# EAGLE schematic core+io5 (EAGLE 6.6.0)

## Sheet 1 of 3
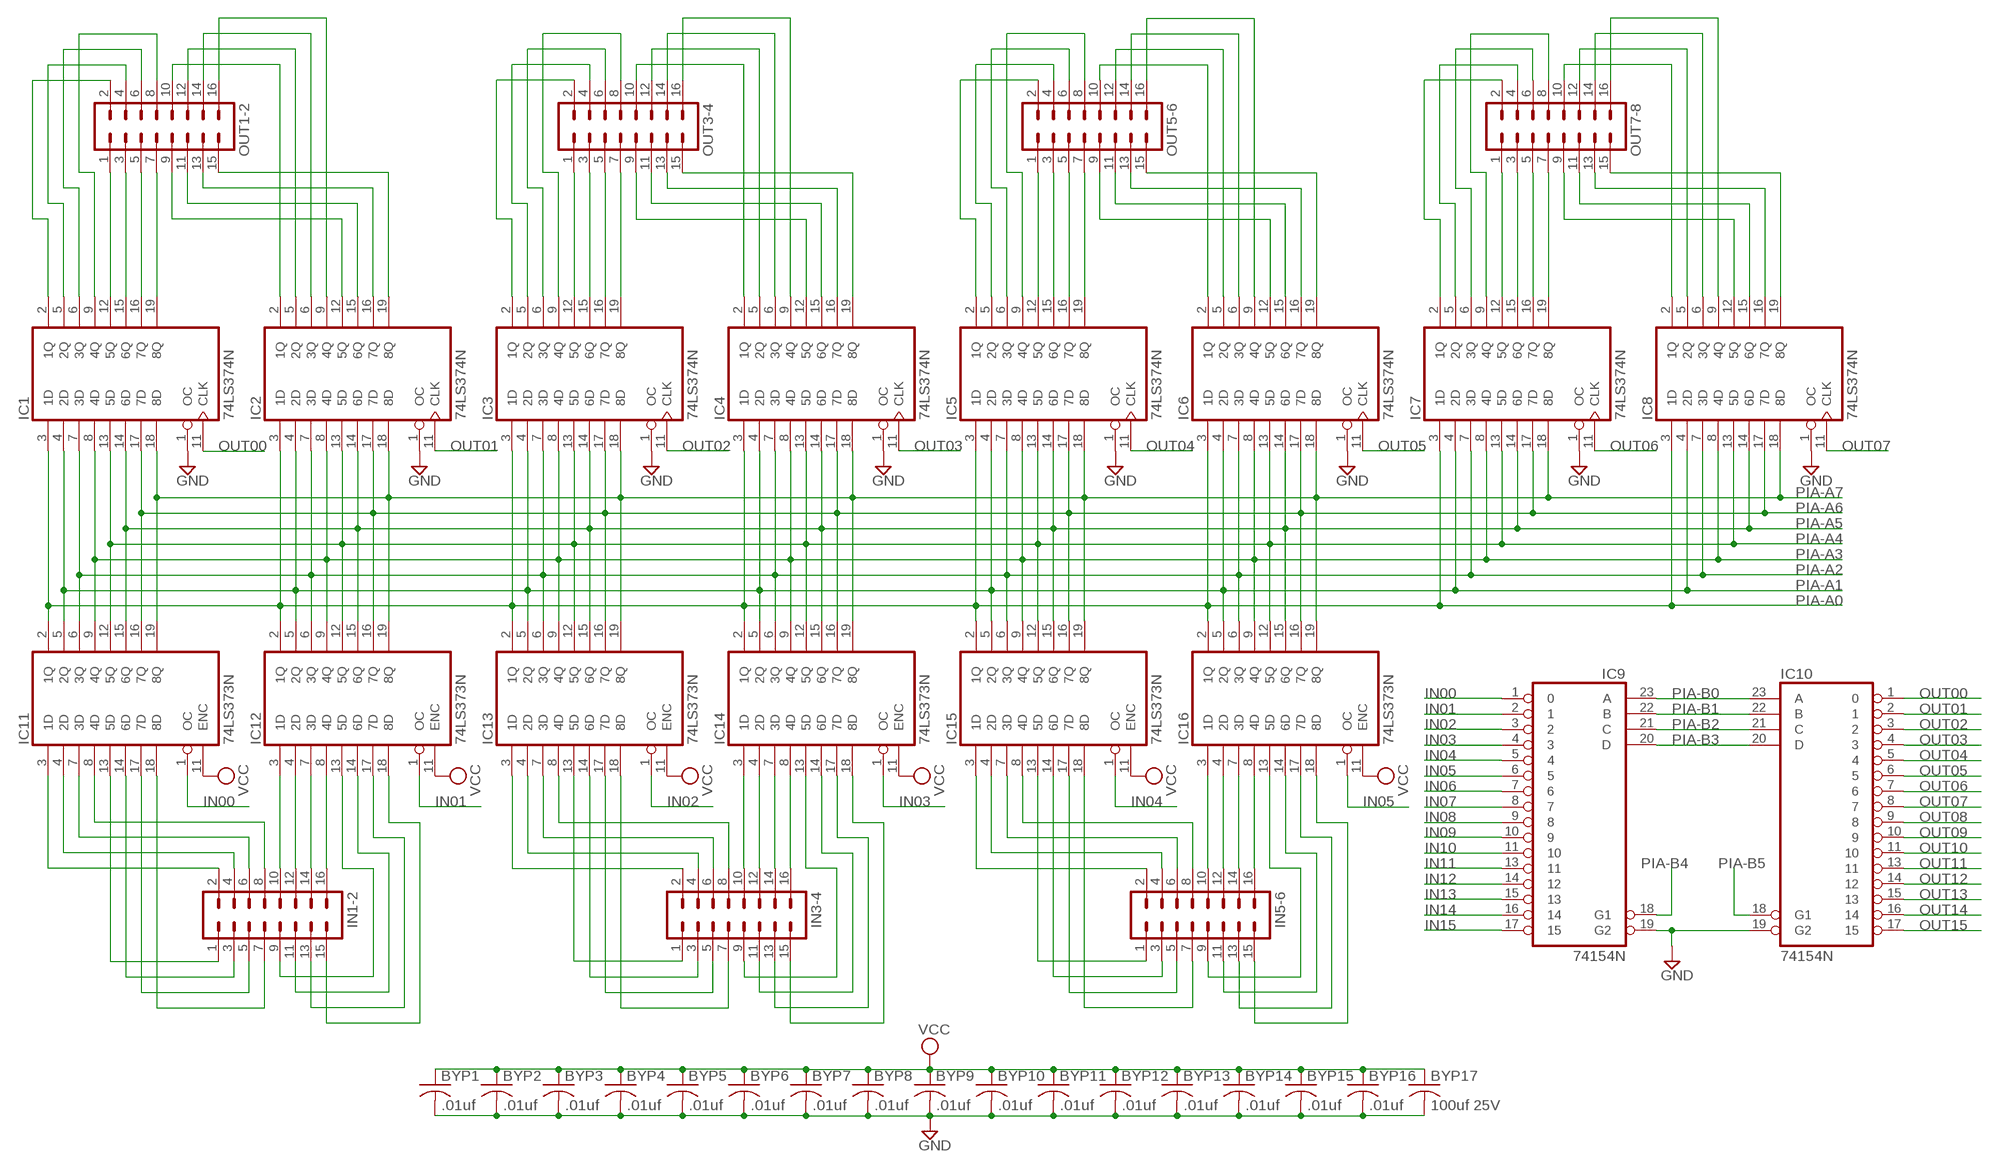
[diagram p0: schematic, sheet 1]

### Parts
BYP1  .01uf  C-US050-025X075  [C050-025X075]
BYP2  .01uf  C-US050-025X075  [C050-025X075]
BYP3  .01uf  C-US050-025X075  [C050-025X075]
BYP4  .01uf  C-US050-025X075  [C050-025X075]
BYP5  .01uf  C-US050-025X075  [C050-025X075]
BYP6  .01uf  C-US050-025X075  [C050-025X075]
BYP7  .01uf  C-US050-025X075  [C050-025X075]
BYP8  .01uf  C-US050-025X075  [C050-025X075]
BYP9  .01uf  C-US050-025X075  [C050-025X075]
BYP10  .01uf  C-US050-025X075  [C050-025X075]
BYP11  .01uf  C-US050-025X075  [C050-025X075]
BYP12  .01uf  C-US050-025X075  [C050-025X075]
BYP13  .01uf  C-US050-025X075  [C050-025X075]
BYP14  .01uf  C-US050-025X075  [C050-025X075]
BYP15  .01uf  C-US050-025X075  [C050-025X075]
BYP16  .01uf  C-US050-025X075  [C050-025X075]
BYP17  100uf 25V  C-US102-043X133  [C102-043X133]
IC1  74LS374N  [DIL20]
IC2  74LS374N  [DIL20]
IC3  74LS374N  [DIL20]
IC4  74LS374N  [DIL20]
IC5  74LS374N  [DIL20]
IC6  74LS374N  [DIL20]
IC7  74LS374N  [DIL20]
IC8  74LS374N  [DIL20]
IC9  74154N  [DIL24-6]
IC10  74154N  [DIL24-6]
IC11  74LS373N  [DIL20]
IC12  74LS373N  [DIL20]
IC13  74LS373N  [DIL20]
IC14  74LS373N  [DIL20]
IC15  74LS373N  [DIL20]
IC16  74LS373N  [DIL20]
IN1-2  MA08-2  [MA08-2]
IN3-4  MA08-2  [MA08-2]
IN5-6  MA08-2  [MA08-2]
OUT1-2  MA08-2  [MA08-2]
OUT3-4  MA08-2  [MA08-2]
OUT5-6  MA08-2  [MA08-2]
OUT7-8  MA08-2  [MA08-2]

### Nets
GND [Power]: BYP1.2 BYP2.2 BYP3.2 BYP4.2 BYP5.2 BYP6.2 BYP7.2 BYP8.2 BYP9.2 BYP10.2 BYP11.2 BYP12.2 BYP13.2 BYP14.2 BYP15.2 BYP16.2 BYP17.2 IC1.1(OC) IC2.1(OC) IC3.1(OC) IC4.1(OC) IC5.1(OC) IC6.1(OC) IC7.1(OC) IC8.1(OC) IC9.19(G2) IC10.19(G2) ; also sheet 2,3
IN00: IC9.1 IC11.1(OC)
IN01: IC9.2 IC12.1(OC)
IN02: IC9.3 IC13.1(OC)
IN03: IC9.4 IC14.1(OC)
IN04: IC9.5 IC15.1(OC)
IN05: IC9.6 IC16.1(OC)
IN06: IC9.7
IN07: IC9.8
IN08: IC9.9
IN09: IC9.10
IN10: IC9.11
IN11: IC9.13
IN12: IC9.14
IN13: IC9.15
IN14: IC9.16
IN15: IC9.17
N$1: IC12.3(1D) IN1-2.10
N$2: IC12.4(2D) IN1-2.12
N$7: IC12.7(3D) IN1-2.14
N$8: IC12.8(4D) IN1-2.16
N$9: IC11.8(4D) IN1-2.8
N$10: IC11.7(3D) IN1-2.6
N$11: IC11.4(2D) IN1-2.4
N$12: IC11.3(1D) IN1-2.2
N$13: IC11.13(5D) IN1-2.1
N$14: IC11.14(6D) IN1-2.3
N$15: IC11.17(7D) IN1-2.5
N$16: IC11.18(8D) IN1-2.7
N$17: IC12.13(5D) IN1-2.9
N$18: IC12.14(6D) IN1-2.11
N$19: IC12.17(7D) IN1-2.13
N$20: IC12.18(8D) IN1-2.15
N$26: IC5.2(1Q) OUT5-6.2
N$29: IC14.3(1D) IN3-4.10
N$30: IC14.4(2D) IN3-4.12
N$31: IC14.7(3D) IN3-4.14
N$32: IC14.8(4D) IN3-4.16
N$33: IC3.12(5Q) OUT3-4.1
N$34: IC3.15(6Q) OUT3-4.3
N$35: IC3.16(7Q) OUT3-4.5
N$36: IC3.19(8Q) OUT3-4.7
N$37: IC13.3(1D) IN3-4.2
N$38: IC13.4(2D) IN3-4.4
N$39: IC13.7(3D) IN3-4.6
N$40: IC13.8(4D) IN3-4.8
N$41: IC14.13(5D) IN3-4.9
N$42: IC14.14(6D) IN3-4.11
N$43: IC14.17(7D) IN3-4.13
N$44: IC14.18(8D) IN3-4.15
N$45: IC13.13(5D) IN3-4.1
N$46: IC13.14(6D) IN3-4.3
N$47: IC13.17(7D) IN3-4.5
N$48: IC13.18(8D) IN3-4.7
N$49: IC3.5(2Q) OUT3-4.4
N$50: IC3.6(3Q) OUT3-4.6
N$51: IC3.2(1Q) OUT3-4.2
N$52: IC3.9(4Q) OUT3-4.8
N$53: IC1.12(5Q) OUT1-2.1
N$54: IC1.15(6Q) OUT1-2.3
N$55: IC1.16(7Q) OUT1-2.5
N$56: IC1.19(8Q) OUT1-2.7
N$57: IC1.2(1Q) OUT1-2.2
N$58: IC1.5(2Q) OUT1-2.4
N$59: IC1.6(3Q) OUT1-2.6
N$60: IC1.9(4Q) OUT1-2.8
N$61: IC2.19(8Q) OUT1-2.15
N$62: IC2.16(7Q) OUT1-2.13
N$63: IC2.15(6Q) OUT1-2.11
N$64: IC2.12(5Q) OUT1-2.9
N$65: IC2.2(1Q) OUT1-2.10
N$66: IC2.5(2Q) OUT1-2.12
N$67: IC2.6(3Q) OUT1-2.14
N$68: IC2.9(4Q) OUT1-2.16
N$69: IC4.2(1Q) OUT3-4.10
N$70: IC4.5(2Q) OUT3-4.12
N$71: IC4.6(3Q) OUT3-4.14
N$72: IC4.9(4Q) OUT3-4.16
N$73: IC4.19(8Q) OUT3-4.15
N$74: IC4.16(7Q) OUT3-4.13
N$75: IC4.15(6Q) OUT3-4.11
N$76: IC4.12(5Q) OUT3-4.9
N$77: IC16.3(1D) IN5-6.10
N$78: IC16.4(2D) IN5-6.12
N$79: IC16.7(3D) IN5-6.14
N$80: IC16.8(4D) IN5-6.16
N$81: IC5.12(5Q) OUT5-6.1
N$82: IC5.15(6Q) OUT5-6.3
N$83: IC5.16(7Q) OUT5-6.5
N$84: IC5.19(8Q) OUT5-6.7
N$85: IC7.12(5Q) OUT7-8.1
N$86: IC7.15(6Q) OUT7-8.3
N$87: IC7.16(7Q) OUT7-8.5
N$88: IC7.19(8Q) OUT7-8.7
N$89: IC5.5(2Q) OUT5-6.4
N$90: IC5.6(3Q) OUT5-6.6
N$91: IC5.9(4Q) OUT5-6.8
N$92: IC6.12(5Q) OUT5-6.9
N$93: IC6.15(6Q) OUT5-6.11
N$95: IC6.16(7Q) OUT5-6.13
N$96: IC6.19(8Q) OUT5-6.15
N$97: IC6.2(1Q) OUT5-6.10
N$98: IC6.5(2Q) OUT5-6.12
N$99: IC6.6(3Q) OUT5-6.14
N$100: IC6.9(4Q) OUT5-6.16
N$101: IC15.3(1D) IN5-6.2
N$102: IC15.4(2D) IN5-6.4
N$103: IC15.7(3D) IN5-6.6
N$104: IC15.8(4D) IN5-6.8
N$105: IC16.13(5D) IN5-6.9
N$106: IC16.14(6D) IN5-6.11
N$107: IC16.17(7D) IN5-6.13
N$108: IC16.18(8D) IN5-6.15
N$109: IC15.13(5D) IN5-6.1
N$110: IC15.14(6D) IN5-6.3
N$111: IC15.17(7D) IN5-6.5
N$112: IC15.18(8D) IN5-6.7
N$113: IC8.19(8Q) OUT7-8.15
N$114: IC8.16(7Q) OUT7-8.13
N$115: IC8.15(6Q) OUT7-8.11
N$116: IC8.12(5Q) OUT7-8.9
N$117: IC8.2(1Q) OUT7-8.10
N$118: IC8.5(2Q) OUT7-8.12
N$119: IC8.6(3Q) OUT7-8.14
N$120: IC8.9(4Q) OUT7-8.16
N$121: IC7.9(4Q) OUT7-8.8
N$122: IC7.6(3Q) OUT7-8.6
N$123: IC7.5(2Q) OUT7-8.4
N$139: IC7.2(1Q) OUT7-8.2
OUT00: IC1.11(CLK) IC10.1
OUT01: IC2.11(CLK) IC10.2
OUT02: IC3.11(CLK) IC10.3
OUT03: IC4.11(CLK) IC10.4
OUT04: IC5.11(CLK) IC10.5
OUT05: IC6.11(CLK) IC10.6
OUT06: IC7.11(CLK) IC10.7
OUT07: IC8.11(CLK) IC10.8
OUT08: IC10.9
OUT09: IC10.10
OUT10: IC10.11
OUT11: IC10.13
OUT12: IC10.14
OUT13: IC10.15
OUT14: IC10.16
OUT15: IC10.17
PIA-A0: IC1.3(1D) IC2.3(1D) IC3.3(1D) IC4.3(1D) IC5.3(1D) IC6.3(1D) IC7.3(1D) IC8.3(1D) IC11.2(1Q) IC12.2(1Q) IC13.2(1Q) IC14.2(1Q) IC15.2(1Q) IC16.2(1Q) ; also sheet 2,3
PIA-A1: IC1.4(2D) IC2.4(2D) IC3.4(2D) IC4.4(2D) IC5.4(2D) IC6.4(2D) IC7.4(2D) IC8.4(2D) IC11.5(2Q) IC12.5(2Q) IC13.5(2Q) IC14.5(2Q) IC15.5(2Q) IC16.5(2Q) ; also sheet 2,3
PIA-A2: IC1.7(3D) IC2.7(3D) IC3.7(3D) IC4.7(3D) IC5.7(3D) IC6.7(3D) IC7.7(3D) IC8.7(3D) IC11.6(3Q) IC12.6(3Q) IC13.6(3Q) IC14.6(3Q) IC15.6(3Q) IC16.6(3Q) ; also sheet 2,3
PIA-A3: IC1.8(4D) IC2.8(4D) IC3.8(4D) IC4.8(4D) IC5.8(4D) IC6.8(4D) IC7.8(4D) IC8.8(4D) IC11.9(4Q) IC12.9(4Q) IC13.9(4Q) IC14.9(4Q) IC15.9(4Q) IC16.9(4Q) ; also sheet 2,3
PIA-A4: IC1.13(5D) IC2.13(5D) IC3.13(5D) IC4.13(5D) IC5.13(5D) IC6.13(5D) IC7.13(5D) IC8.13(5D) IC11.12(5Q) IC12.12(5Q) IC13.12(5Q) IC14.12(5Q) IC15.12(5Q) IC16.12(5Q) ; also sheet 2,3
PIA-A5: IC1.14(6D) IC2.14(6D) IC3.14(6D) IC4.14(6D) IC5.14(6D) IC6.14(6D) IC7.14(6D) IC8.14(6D) IC11.15(6Q) IC12.15(6Q) IC13.15(6Q) IC14.15(6Q) IC15.15(6Q) IC16.15(6Q) ; also sheet 2,3
PIA-A6: IC1.17(7D) IC2.17(7D) IC3.17(7D) IC4.17(7D) IC5.17(7D) IC6.17(7D) IC7.17(7D) IC8.17(7D) IC11.16(7Q) IC12.16(7Q) IC13.16(7Q) IC14.16(7Q) IC15.16(7Q) IC16.16(7Q) ; also sheet 2,3
PIA-A7: IC1.18(8D) IC2.18(8D) IC3.18(8D) IC4.18(8D) IC5.18(8D) IC6.18(8D) IC7.18(8D) IC8.18(8D) IC11.19(8Q) IC12.19(8Q) IC13.19(8Q) IC14.19(8Q) IC15.19(8Q) IC16.19(8Q) ; also sheet 2,3
PIA-B0: IC9.23(A) IC10.23(A) ; also sheet 2,3
PIA-B1: IC9.22(B) IC10.22(B) ; also sheet 2,3
PIA-B2: IC9.21(C) IC10.21(C) ; also sheet 2,3
PIA-B3: IC9.20(D) IC10.20(D) ; also sheet 2,3
PIA-B4: IC9.18(G1) ; also sheet 2,3
PIA-B5: IC10.18(G1) ; also sheet 2,3
VCC [Power]: BYP1.1 BYP2.1 BYP3.1 BYP4.1 BYP5.1 BYP6.1 BYP7.1 BYP8.1 BYP9.1 BYP10.1 BYP11.1 BYP12.1 BYP13.1 BYP14.1 BYP15.1 BYP16.1 BYP17.1 IC11.11(ENC) IC12.11(ENC) IC13.11(ENC) IC14.11(ENC) IC15.11(ENC) IC16.11(ENC) ; also sheet 2,3

## Sheet 2 of 3
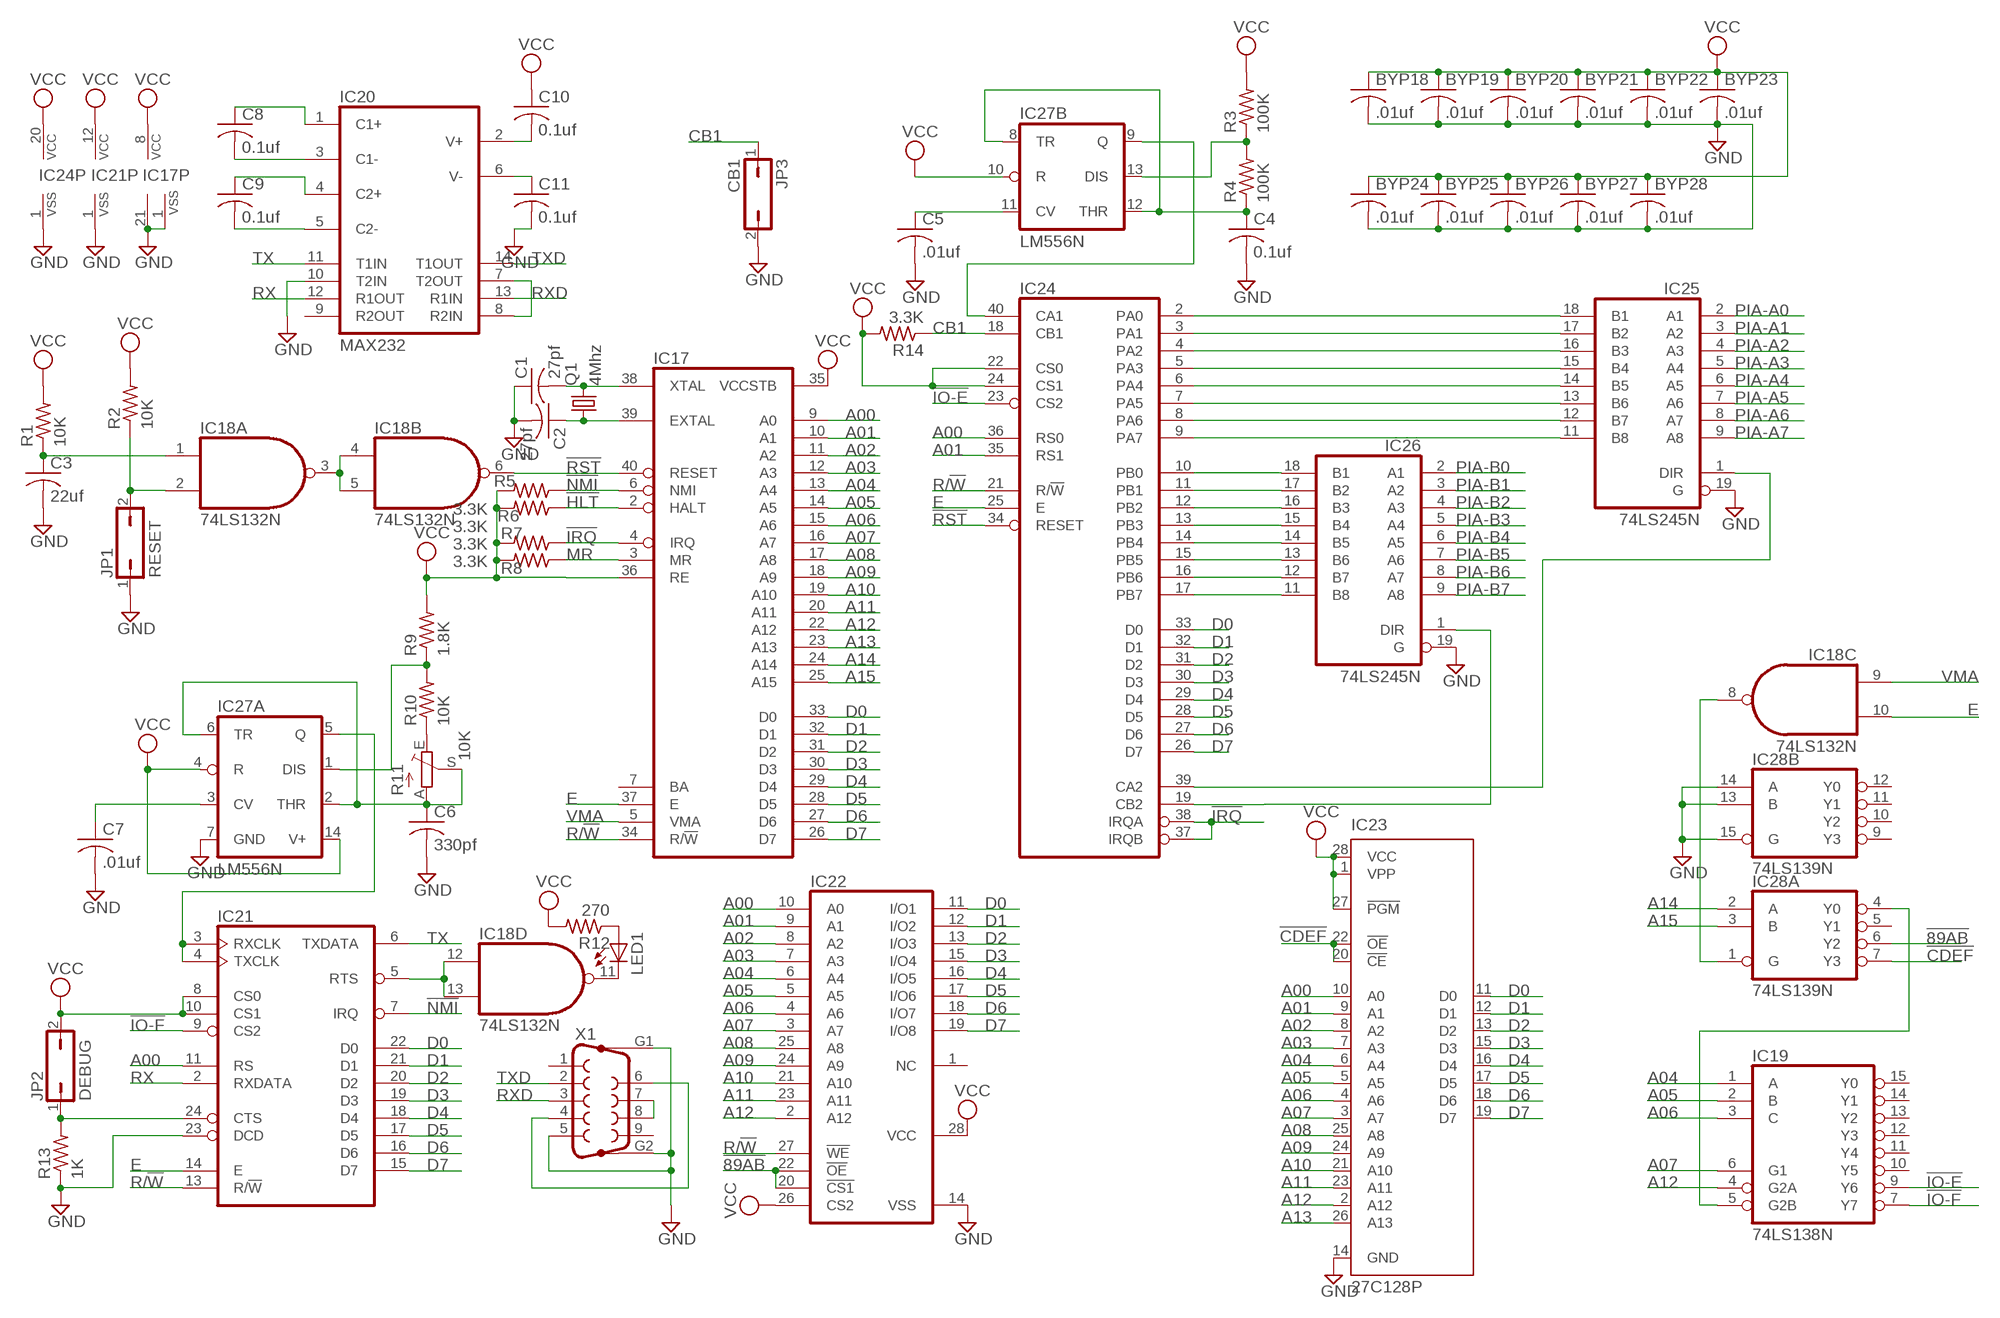
[diagram p1: schematic, sheet 2]

### Parts
BYP18  .01uf  C-US050-025X075  [C050-025X075]
BYP19  .01uf  C-US050-025X075  [C050-025X075]
BYP20  .01uf  C-US050-025X075  [C050-025X075]
BYP21  .01uf  C-US050-025X075  [C050-025X075]
BYP22  .01uf  C-US050-025X075  [C050-025X075]
BYP23  .01uf  C-US050-025X075  [C050-025X075]
BYP24  .01uf  C-US050-025X075  [C050-025X075]
BYP25  .01uf  C-US050-025X075  [C050-025X075]
BYP26  .01uf  C-US050-025X075  [C050-025X075]
BYP27  .01uf  C-US050-025X075  [C050-025X075]
BYP28  .01uf  C-US050-025X075  [C050-025X075]
C1  27pf  C-US050-025X075  [C050-025X075]
C2  27pf  C-US050-025X075  [C050-025X075]
C3  22uf  C-US102-043X133  [C102-043X133]
C4  0.1uf  C-US050-025X075  [C050-025X075]
C5  .01uf  C-US050-025X075  [C050-025X075]
C6  330pf  C-US050-025X075  [C050-025X075]
C7  .01uf  C-US050-025X075  [C050-025X075]
C8  0.1uf  C-US050-025X075  [C050-025X075]
C9  0.1uf  C-US050-025X075  [C050-025X075]
C10  0.1uf  C-US050-025X075  [C050-025X075]
C11  0.1uf  C-US050-025X075  [C050-025X075]
IC17  6802  [DIL40]
IC18  74LS132N  74LS00N  [DIL14]
IC19  74LS138N  [DIL16]
IC20  MAX232  [DIL16]
IC21  6850  [DIL24]
IC22  6264A  [DIL28-6]
IC23  27C128P  [DIL28-6]
IC24  6821  [DIL40]
IC25  74LS245N  [DIL20]
IC26  74LS245N  [DIL20]
IC27  LM556N  [DIL14]
IC28  74LS139N  [DIL16]
JP1  RESET  JP1Q  [JP1]
JP2  DEBUG  JP1Q  [JP1]
JP3  CB1  JP1Q  [JP1]
LED1  LED3MM  [LED3MM]
Q1  4Mhz  CRYSTALHC18U-V  [HC18U-V]
R1  10K  R-US_0207/7  [0207/7]
R2  10K  R-US_0207/7  [0207/7]
R3  100K  R-US_0207/7  [0207/7]
R4  100K  R-US_0207/7  [0207/7]
R5  3.3K  R-US_0207/7  [0207/7]
R6  3.3K  R-US_0207/7  [0207/7]
R7  3.3K  R-US_0207/7  [0207/7]
R8  3.3K  R-US_0207/7  [0207/7]
R9  1.8K  R-US_0207/7  [0207/7]
R10  10K  R-US_0207/7  [0207/7]
R11  10K  TRIM_EU-B90P  [SP19L]
R12  270  R-US_0207/7  [0207/7]
R13  1K  R-US_0207/7  [0207/7]
R14  3.3K  R-US_0207/7  [0207/7]
X1  F09HP  [F09HP]

### Nets
!89AB: IC22.20(!CS1) IC22.22(!OE) IC28.6(A:Y2)
!CDEF: IC23.20(!CE) IC23.22(!OE) IC28.7(A:Y3)
!HLT: IC17.2(HALT) R5.1
!IO-E: IC19.9(Y6) IC24.23(CS2)
!IO-F: IC19.7(Y7) IC21.9(CS2)
!IRQ: IC17.4(IRQ) IC24.37(IRQB) IC24.38(IRQA) R7.1
!NMI: IC17.6(NMI) IC21.7(IRQ) R6.1
!RST: IC17.40(RESET) IC18.6(B:O) IC24.34(RESET)
A00: IC17.9(A0) IC21.11(RS) IC22.10(A0) IC23.10(A0) IC24.36(RS0)
A01: IC17.10(A1) IC22.9(A1) IC23.9(A1) IC24.35(RS1)
A02: IC17.11(A2) IC22.8(A2) IC23.8(A2)
A03: IC17.12(A3) IC22.7(A3) IC23.7(A3)
A04: IC17.13(A4) IC19.1(A) IC22.6(A4) IC23.6(A4)
A05: IC17.14(A5) IC19.2(B) IC22.5(A5) IC23.5(A5)
A06: IC17.15(A6) IC19.3(C) IC22.4(A6) IC23.4(A6)
A07: IC17.16(A7) IC19.6(G1) IC22.3(A7) IC23.3(A7)
A08: IC17.17(A8) IC22.25(A8) IC23.25(A8)
A09: IC17.18(A9) IC22.24(A9) IC23.24(A9)
A10: IC17.19(A10) IC22.21(A10) IC23.21(A10)
A11: IC17.20(A11) IC22.23(A11) IC23.23(A11)
A12: IC17.22(A12) IC19.4(G2A) IC22.2(A12) IC23.2(A12)
A13: IC17.23(A13) IC23.26(A13)
A14: IC17.24(A14) IC28.2(A:A)
A15: IC17.25(A15) IC28.3(A:B)
CB1: IC24.18(CB1) JP3.1 R14.1
D0: IC17.33(D0) IC21.22(D0) IC22.11(I/O1) IC23.11(D0) IC24.33(D0)
D1: IC17.32(D1) IC21.21(D1) IC22.12(I/O2) IC23.12(D1) IC24.32(D1)
D2: IC17.31(D2) IC21.20(D2) IC22.13(I/O3) IC23.13(D2) IC24.31(D2)
D3: IC17.30(D3) IC21.19(D3) IC22.15(I/O4) IC23.15(D3) IC24.30(D3)
D4: IC17.29(D4) IC21.18(D4) IC22.16(I/O5) IC23.16(D4) IC24.29(D4)
D5: IC17.28(D5) IC21.17(D5) IC22.17(I/O6) IC23.17(D5) IC24.28(D5)
D6: IC17.27(D6) IC21.16(D6) IC22.18(I/O7) IC23.18(D6) IC24.27(D6)
D7: IC17.26(D7) IC21.15(D7) IC22.19(I/O8) IC23.19(D7) IC24.26(D7)
E: IC17.37(E) IC18.10(C:I1) IC21.14(E) IC24.25(E)
GND [Power]: BYP18.2 BYP19.2 BYP20.2 BYP21.2 BYP22.2 BYP23.2 BYP24.2 BYP25.2 BYP26.2 BYP27.2 BYP28.2 C1.1 C2.2 C3.2 C4.2 C5.2 C6.2 C7.2 C11.2 IC17.1(VSS) IC17.21(VSS) IC20.10(T2IN) IC21.1(VSS) IC21.23(DCD) IC22.14(VSS) IC23.14(GND) IC24.1(VSS) IC25.19(G) IC26.19(G) IC27.7(A:GND) IC28.13(B:B) IC28.14(B:A) IC28.15(B:G) JP1.1 JP3.2 R13.1 X1.5 X1.G1 X1.G2 ; also sheet 1,3
MR: IC17.3(MR) R8.1
N$3: C2.1 IC17.39(EXTAL) Q1.1
N$4: C1.2 IC17.38(XTAL) Q1.2
N$5: IC24.2(PA0) IC25.18(B1)
N$6: IC18.3(A:O) IC18.4(B:I0) IC18.5(B:I1)
N$21: C3.1 IC18.1(A:I0) R1.1
N$22: IC18.2(A:I1) JP1.2 R2.1
N$23: IC21.3(RXCLK) IC21.4(TXCLK) IC27.5(A:Q)
N$24: IC24.10(PB0) IC26.18(B1)
N$25: IC24.11(PB1) IC26.17(B2)
N$27: C6.1 IC27.2(A:THR) IC27.6(A:TR) R11.A R11.S
N$28: IC27.1(A:DIS) R9.1 R10.2
N$94: IC24.12(PB2) IC26.16(B3)
N$124: IC24.13(PB3) IC26.15(B4)
N$125: IC24.14(PB4) IC26.14(B5)
N$126: IC24.15(PB5) IC26.13(B6)
N$127: IC24.16(PB6) IC26.12(B7)
N$128: IC24.17(PB7) IC26.11(B8)
N$129: IC24.3(PA1) IC25.17(B2)
N$130: IC24.4(PA2) IC25.16(B3)
N$131: IC24.5(PA3) IC25.15(B4)
N$132: IC24.6(PA4) IC25.14(B5)
N$133: IC24.7(PA5) IC25.13(B6)
N$134: IC24.8(PA6) IC25.12(B7)
N$135: IC24.9(PA7) IC25.11(B8)
N$136: IC24.19(CB2) IC26.1(DIR)
N$137: IC24.39(CA2) IC25.1(DIR)
N$138: IC24.40(CA1) IC27.9(B:Q)
N$140: C4.1 IC27.8(B:TR) IC27.12(B:THR) R4.1
N$141: IC27.13(B:DIS) R3.1 R4.2
N$142: C5.1 IC27.11(B:CV)
N$143: R10.1 R11.E
N$144: X1.4 X1.6
N$145: X1.7 X1.8
N$147: IC18.12(D:I0) IC18.13(D:I1) IC21.5(RTS)
N$148: IC18.11(D:O) LED1.K(C)
N$149: LED1.A R12.1
N$150: IC21.24(CTS) JP2.1 R13.2
N$151: IC18.8(C:O) IC28.1(A:G)
N$152: IC19.5(G2B) IC28.4(A:Y0)
N$153: IC20.7(T2OUT) IC20.8(R2IN)
N$154: C7.1 IC27.3(A:CV)
N$155: C9.2 IC20.5(C2-)
N$156: C9.1 IC20.4(C2+)
N$157: C8.2 IC20.3(C1-)
N$158: C8.1 IC20.1(C1+)
N$159: C11.1 IC20.6(V-)
N$160: C10.2 IC20.2(V+)
PIA-A0: IC25.2(A1) ; also sheet 1,3
PIA-A1: IC25.3(A2) ; also sheet 1,3
PIA-A2: IC25.4(A3) ; also sheet 1,3
PIA-A3: IC25.5(A4) ; also sheet 1,3
PIA-A4: IC25.6(A5) ; also sheet 1,3
PIA-A5: IC25.7(A6) ; also sheet 1,3
PIA-A6: IC25.8(A7) ; also sheet 1,3
PIA-A7: IC25.9(A8) ; also sheet 1,3
PIA-B0: IC26.2(A1) ; also sheet 1,3
PIA-B1: IC26.3(A2) ; also sheet 1,3
PIA-B2: IC26.4(A3) ; also sheet 1,3
PIA-B3: IC26.5(A4) ; also sheet 1,3
PIA-B4: IC26.6(A5) ; also sheet 1,3
PIA-B5: IC26.7(A6) ; also sheet 1,3
PIA-B6: IC26.8(A7) ; also sheet 3
PIA-B7: IC26.9(A8) ; also sheet 3
R/!W: IC17.34(R/!W) IC21.13(R/!W) IC22.27(!WE) IC24.21(R/!W)
RX: IC20.12(R1OUT) IC21.2(RXDATA)
RXD: IC20.13(R1IN) X1.3
TX: IC20.11(T1IN) IC21.6(TXDATA)
TXD: IC20.14(T1OUT) X1.2
VCC [Power]: BYP18.1 BYP19.1 BYP20.1 BYP21.1 BYP22.1 BYP23.1 BYP24.1 BYP25.1 BYP26.1 BYP27.1 BYP28.1 C10.1 IC17.8(VCC) IC17.35(VCCSTB) IC17.36(RE) IC21.8(CS0) IC21.10(CS1) IC21.12(VCC) IC22.26(CS2) IC22.28(VCC) IC23.1(VPP) IC23.27(!PGM) IC23.28(VCC) IC24.20(VCC) IC24.22(CS0) IC24.24(CS1) IC27.4(A:R) IC27.10(B:R) IC27.14(A:V+) JP2.2 R1.2 R2.2 R3.2 R5.2 R6.2 R7.2 R8.2 R9.2 R12.2 R14.2 ; also sheet 1,3
VMA: IC17.5(VMA) IC18.9(C:I0)
Unconnected: IC17.7(BA) IC19.10(Y5) IC19.11(Y4) IC19.12(Y3) IC19.13(Y2) IC19.14(Y1) IC19.15(Y0) IC20.9(R2OUT) IC22.1(NC) IC28.5(A:Y1) IC28.9(B:Y3) IC28.10(B:Y2) IC28.11(B:Y1) IC28.12(B:Y0) X1.1 X1.9

## Sheet 3 of 3
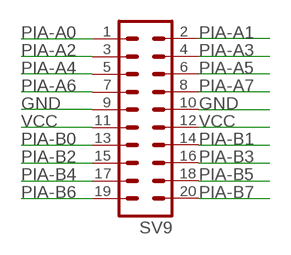
[diagram p2: schematic, sheet 3]

### Parts
SV9  MA10-2  [MA10-2]

### Nets
GND [Power]: SV9.9 SV9.10 ; also sheet 1,2
PIA-A0: SV9.1 ; also sheet 1,2
PIA-A1: SV9.2 ; also sheet 1,2
PIA-A2: SV9.3 ; also sheet 1,2
PIA-A3: SV9.4 ; also sheet 1,2
PIA-A4: SV9.5 ; also sheet 1,2
PIA-A5: SV9.6 ; also sheet 1,2
PIA-A6: SV9.7 ; also sheet 1,2
PIA-A7: SV9.8 ; also sheet 1,2
PIA-B0: SV9.13 ; also sheet 1,2
PIA-B1: SV9.14 ; also sheet 1,2
PIA-B2: SV9.15 ; also sheet 1,2
PIA-B3: SV9.16 ; also sheet 1,2
PIA-B4: SV9.17 ; also sheet 1,2
PIA-B5: SV9.18 ; also sheet 1,2
PIA-B6: SV9.19 ; also sheet 2
PIA-B7: SV9.20 ; also sheet 2
VCC [Power]: SV9.11 SV9.12 ; also sheet 1,2

## Power pins joined to a net without a drawn wire
GND: IC1.10(GND) IC2.10(GND) IC3.10(GND) IC4.10(GND) IC5.10(GND) IC6.10(GND) IC7.10(GND) IC8.10(GND) IC9.12(GND) IC10.12(GND) IC11.10(GND) IC12.10(GND) IC13.10(GND) IC14.10(GND) IC15.10(GND) IC16.10(GND) IC18.7(P:GND) IC19.8(GND) IC20.15(GND) IC25.10(GND) IC26.10(GND) IC28.8(P:GND)
VCC: IC1.20(VCC) IC2.20(VCC) IC3.20(VCC) IC4.20(VCC) IC5.20(VCC) IC6.20(VCC) IC7.20(VCC) IC8.20(VCC) IC9.24(VCC) IC10.24(VCC) IC11.20(VCC) IC12.20(VCC) IC13.20(VCC) IC14.20(VCC) IC15.20(VCC) IC16.20(VCC) IC18.14(P:VCC) IC19.16(VCC) IC20.16(VCC) IC25.20(VCC) IC26.20(VCC) IC28.16(P:VCC)

## Library data of the parts
BYP1-BYP28 C1-C11 = rcl:C-US: CAPACITOR, American symbol
IC1-IC8 = 74xx-us:74*374: Octal D type transparent LATCH, edge triggered
IC9 IC10 = 74xx-us:74*154: 4-line to 16-line data SELECTOR/MULTIPLEXER
IC11-IC16 = 74xx-us:74*373: Octal D type transparent LATCH, edge triggered
IC17 = micro-motorola:6802: MICROCONTROLLER/MEMORY DEVICE; OC_FARNELL: unknown; OC_NEWARK: unknown
IC18 = 74xx-us:74*00: Quad 2-input NAND gate
IC19 = 74xx-us:74*138: 3-line to 8-line DECODER/DEMULTIPLEXER
IC20 = maxim:MAX232: RS232 TRANSCEIVER; MF: MAXIM; MPN: MAX232ACPE+; OC_FARNELL: 9723773; OC_NEWARK: 68K4544
IC21 = micro-motorola:6850: MICROCONTROLLER/MEMORY DEVICE; MF: NTE ELECTRONICS; MPN: NTE6850; OC_FARNELL: 4899775; OC_NEWARK: 31C2457
IC22 = memory-hitachi:6264A: MEMORY; OC_FARNELL: 283605; OC_NEWARK: unknown
IC23 = microchip:27*128: CMOS EPROM 128 K (16 K x 8); OC_FARNELL: unknown; OC_NEWARK: unknown
IC24 = micro-motorola:6821: MICROCONTROLLER/MEMORY DEVICE; MF: NTE ELECTRONICS; MPN: NTE6821; OC_FARNELL: 1652403; OC_NEWARK: 29C4772
IC25 IC26 = 74xx-us:74*245: Octal BUS TRANSCEIVER, 3-state
IC27 = linear:*556: Dual TIMER
IC28 = 74xx-us:74*139: Dual 2-line to 4-line DECODER/DEMULTIPLEXER
IN1-2 IN3-4 IN5-6 OUT1-2 OUT3-4 OUT5-6 OUT7-8 = con-lstb:MA08-2: PIN HEADER; OC_FARNELL: unknown; OC_NEWARK: unknown
JP1-JP3 = jumper:JP1Q: JUMPER
LED1 = led:LED: LED OSRAM: - CHIPLED LG R971, LG N971, LY N971, LG Q971, LY Q971, LO R971, LY R971 LH N974, LH R974 LS Q976, LO Q976, LY Q976 LO Q996 - Hyper CHIPLED LW Q18S LB Q993, LB Q99A, LB R99A - SideLED LS A670, LO A670, LY A670, LG A670, LP A670 LB A673, LV A673, LT A673, LW A673 LH A674 LY A675 LS A676, LA A676, LO A676, LY A676, LW A676 LS A679, LY A679, LG A679 - Hyper Micro SIDELED® LS Y876, LA Y876, LO Y876, LY Y876 LT Y87S - SmartLED LW L88C, LW L88S LB L89C, LB L89S, LG L890 LS L89K, LO L89K, LY L89K LS L896, LA L896, LO L896, LY L896 - TOPLED LS T670, LO T670, LY T670, LG T670, LP T670 LSG T670, LSP T670, LSY T670, LOP T670, LYG T670 LG T671, LOG T671, LSG T671 LB T673, LV T673, LT T673, LW T673 LH T674 LS T676, LA T676, LO T676, LY T676, LB T676, LH T676, LSB T676, LW T676 LB T67C, LV T67C, LT T67C, LS T67K, LO T67K, LY T67K, LW E67C LS E67B, LA E67B, LO E67B, LY E67B, LB E67C, LV E67C, LT E67C LW T67C LS T679, LY T679, LG T679 LS T770, LO T770, LY T770, LG T770, LP T770 LB T773, LV T773, LT T773, LW T773 LH T774 LS E675, LA E675, LY E675, LS T675 LS T776, LA T776, LO T776, LY T776, LB T776 LHGB T686 LT T68C, LB T68C - Hyper Mini TOPLED® LB M676 - Mini TOPLED Santana® LG M470 LS M47K, LO M47K, LY M47K Source: http://www.osram.convergy.de LUXEON: - LUMILED® LXK2-PW12-R00, LXK2-PW12-S00, LXK2-PW14-U00, LXK2-PW14-V00 LXK2-PM12-R00, LXK2-PM12-S00, LXK2-PM14-U00 LXK2-PE12-Q00, LXK2-PE12-R00, LXK2-PE12-S00, LXK2-PE14-T00, LXK2-PE14-U00 LXK2-PB12-K00, LXK2-PB12-L00, LXK2-PB12-M00, LXK2-PB14-N00, LXK2-PB14-P00, LXK2-PB14-Q00 LXK2-PR12-L00, LXK2-PR12-M00, LXK2-PR14-Q00, LXK2-PR14-R00 LXK2-PD12-Q00, LXK2-PD12-R00, LXK2-PD12-S00 LXK2-PH12-R00, LXK2-PH12-S00 LXK2-PL12-P00, LXK2-PL12-Q00, LXK2-PL12-R00 Source: www.luxeon.com KINGBRIGHT: KA-3528ASYC Source: www.kingbright.com
Q1 = crystal:CRYSTAL: CRYSTAL; OC_FARNELL: unknown; OC_NEWARK: unknown
R1-R10 R12-R14 = rcl:R-US_: RESISTOR, American symbol
R11 = pot:TRIM_EU-: POTENTIOMETER
SV9 = con-lstb:MA10-2: PIN HEADER; OC_FARNELL: unknown; OC_NEWARK: unknown
X1 = con-subd:F09HP: SUB-D; OC_FARNELL: unknown; OC_NEWARK: unknown

## Net classes
1 Power: width 0.508 mm, drill 0.254 mm, clearance 0.254 mm